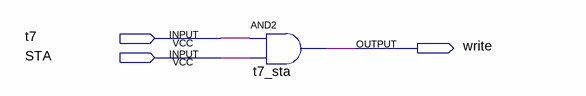
[diagram p0: schematic sheet]
// Quartus schematic write.bdf as structural Verilog: 1 symbols, 3 pins
module write (
  input  t7,
  input  STA,
  output write
);

  and t7_sta (write, t7, STA);
endmodule
